# Altium schematic sheet Sheet8.SchDoc
size A4
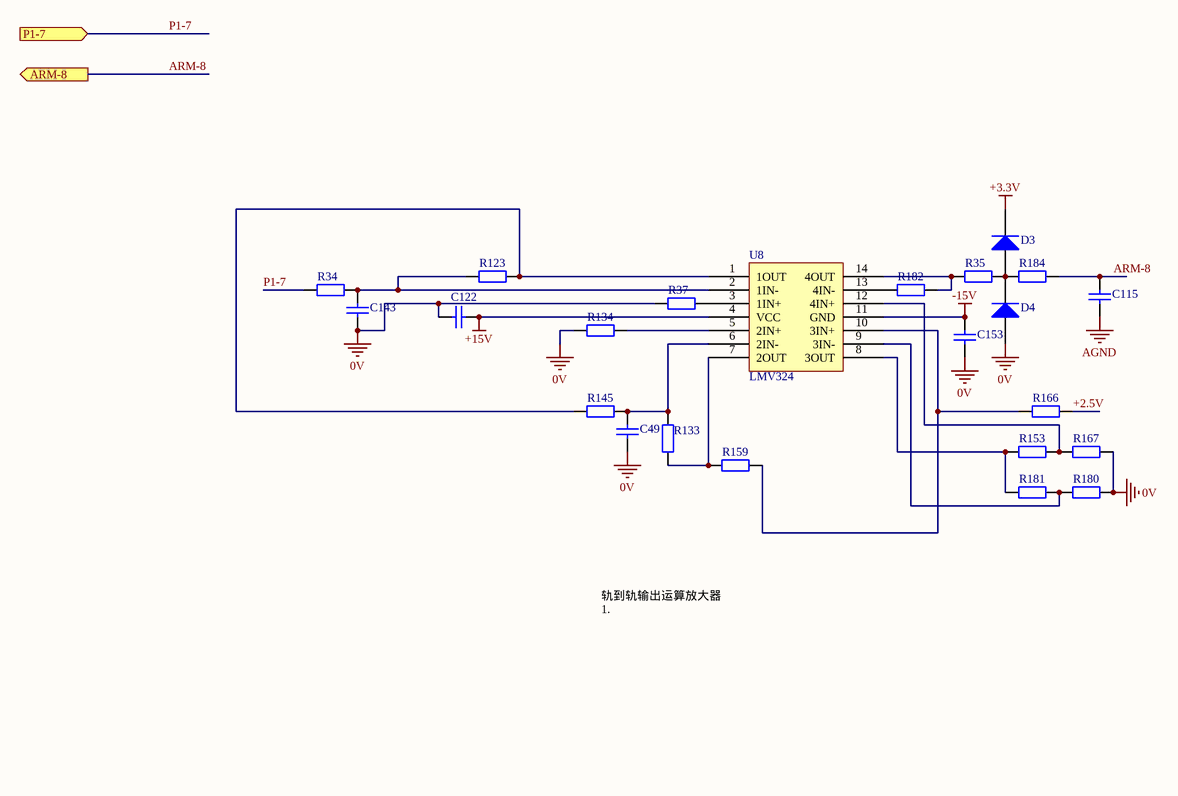
[diagram p0: Sheet8.SchDoc]

## Parts
C49  Cap  [RAD-0.3]  (value not drawn)
C115  Cap  [RAD-0.3]  (value not drawn)
C122  Cap  [RAD-0.3]  (value not drawn)
C143  Cap  [RAD-0.3]  (value not drawn)
C153  Cap  [RAD-0.3]  (value not drawn)
D3  Diode 1N4007  [DO-41]  (value not drawn)
D4  Diode 1N4007  [DO-41]  (value not drawn)
R34  Res2  [AXIAL-0.4]  (value not drawn)
R35  Res2  [AXIAL-0.4]  (value not drawn)
R37  Res2  [AXIAL-0.4]  (value not drawn)
R123  Res2  [AXIAL-0.4]  (value not drawn)
R133  Res2  [AXIAL-0.4]  (value not drawn)
R134  Res2  [AXIAL-0.4]  (value not drawn)
R145  Res2  [AXIAL-0.4]  (value not drawn)
R153  Res2  [AXIAL-0.4]  (value not drawn)
R159  Res2  [AXIAL-0.4]  (value not drawn)
R166  Res2  [AXIAL-0.4]  (value not drawn)
R167  Res2  [AXIAL-0.4]  (value not drawn)
R180  Res2  [AXIAL-0.4]  (value not drawn)
R181  Res2  [AXIAL-0.4]  (value not drawn)
R182  Res2  [AXIAL-0.4]  (value not drawn)
R184  Res2  [AXIAL-0.4]  (value not drawn)
U8  LMV324

## Ports
ARM-8 (out), P1-7 (in)

## Nets
0V: C49.1 C122.2 C143.1 C153.1 D4.1(A) R37.2 R134.2 R167.2 R180.2
+3.3V: D3.2(K)
+15V: C122.1 U8.4(VCC)
-15V: C153.2 U8.11(GND)
AGND: C115.1
+2.5V: R166.2
ARM-8: C115.2 R184.2 ; port ARM-8
P1-7: R34.2 ; port P1-7
NetC49_2: C49.2 R133.2 R145.1 U8.6(2IN-)
NetC143_2: C143.2 R34.1 R123.2 U8.2(1IN-)
NetD3_1: D3.1(A) D4.2(K) R35.2 R184.1
NetR35_1: R35.1 R182.2 U8.14(4OUT)
NetR37_1: R37.1 U8.3(1IN+)
NetR123_1: R123.1 R145.2 U8.1(1OUT)
NetR133_1: R133.1 R159.1 U8.7(2OUT)
NetR134_1: R134.1 U8.5(2IN+)
NetR153_1: R153.1 R181.1 U8.8(3OUT)
NetR153_2: R153.2 R167.1 U8.12(4IN+)
NetR159_2: R159.2 R166.1 U8.10(3IN+)
NetR180_1: R180.1 R181.2 U8.9(3IN-)
NetR182_1: R182.1 U8.13(4IN-)

## Notes on the sheet
- 轨到轨输出运算放大器
  1.

## Library data of the parts
C49 C115 C122 C143 C153 = Cap: Capacitor; Value: 100pF; Published: 8-Jun-2000; LatestRevisionDate: 17-Jul-2002; LatestRevisionNote: Re-released for DXP Platform.; PackageReference: RAD-0.3; Publisher: Altium Limited
D3 D4 = Diode 1N4007: 1 Amp General Purpose Rectifier; Published: 8-Jun-2000; LatestRevisionDate: 17-Jul-2002; LatestRevisionNote: Re-released for DXP Platform.; DatasheetDocument: 1998; PackageDocument: Aug-1999; PackageReference: DO-41; Publisher: Altium Limited; Code_JEDEC: DO-204-AL; ComponentLink1Description: Manufacturer Link; ComponentLink1URL: http://www.fairchildsemi.com/; ComponentLink2Description: Datasheet; ComponentLink2URL: http://www.fairchildsemi.com/ds/1N%2F1N4001.pdf
R34 R35 R37 R123 R133 R134 R145 R153 R159 R166 R167 R180-R182 R184 = Res2: Resistor; Value: 1K; Published: 8-Jun-2000; LatestRevisionDate: 17-Jul-2002; LatestRevisionNote: Re-released for DXP Platform.; PackageReference: AXIAL-0.4; Publisher: Altium Limited
U8 = Component_1